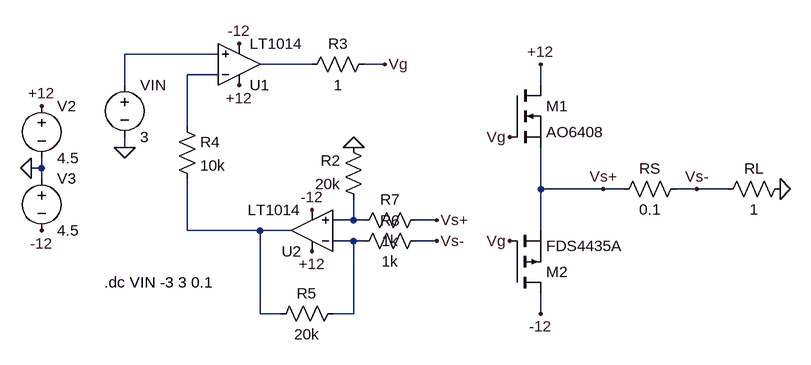
[diagram p0: schematic AmpOpDriverBipolar_v2.asc]
AmpOpDriverBipolar_v2.asc, the LTspice schematic file:
Version 4
SHEET 1 880 680
WIRE -368 -64 -512 -64
WIRE -224 -48 -304 -48
WIRE -112 -48 -144 -48
WIRE -368 -32 -416 -32
WIRE -512 -16 -512 -64
WIRE 128 -16 128 -48
WIRE -416 48 -416 -32
WIRE -512 80 -512 64
WIRE -640 112 -640 96
WIRE -640 112 -656 112
WIRE -640 128 -640 112
WIRE 128 144 128 80
WIRE 224 144 128 144
WIRE 256 144 224 144
WIRE 368 144 336 144
WIRE 416 144 368 144
WIRE -160 192 -160 160
WIRE -160 192 -192 192
WIRE -144 192 -160 192
WIRE -32 192 -64 192
WIRE -416 208 -416 128
WIRE -304 208 -416 208
WIRE -256 208 -304 208
WIRE 128 208 128 144
WIRE -160 224 -192 224
WIRE -144 224 -160 224
WIRE -32 224 -64 224
WIRE -304 336 -304 208
WIRE -272 336 -304 336
WIRE -160 336 -160 224
WIRE -160 336 -192 336
WIRE 128 336 128 304
FLAG 496 144 0
FLAG 128 -48 +12
FLAG -112 -48 Vg
FLAG -32 192 Vs+
FLAG -32 224 Vs-
FLAG 80 64 Vg
FLAG -656 112 0
FLAG -640 16 +12
FLAG -224 240 +12
FLAG -336 -16 +12
FLAG -640 208 -12
FLAG -512 80 0
FLAG -224 176 -12
FLAG -336 -80 -12
FLAG -160 80 0
FLAG 128 336 -12
FLAG 224 144 Vs+
FLAG 368 144 Vs-
FLAG 80 224 Vg
SYMBOL res 240 160 R270
WINDOW 0 32 56 VTop 2
WINDOW 3 0 56 VBottom 2
SYMATTR InstName RS
SYMATTR Value 0.1
SYMBOL res 512 128 R90
WINDOW 0 0 56 VBottom 2
WINDOW 3 32 56 VTop 2
SYMATTR InstName RL
SYMATTR Value 1
SYMBOL OpAmps\\LT1014 -336 16 M180
SYMATTR InstName U1
SYMBOL OpAmps\\LT1014 -224 272 R180
SYMATTR InstName U2
SYMBOL res -128 -64 R90
WINDOW 0 0 56 VBottom 2
WINDOW 3 32 56 VTop 2
SYMATTR InstName R3
SYMATTR Value 1
SYMBOL res -432 32 R0
SYMATTR InstName R4
SYMATTR Value 10k
SYMBOL res -176 320 R90
WINDOW 0 0 56 VBottom 2
WINDOW 3 32 56 VTop 2
SYMATTR InstName R5
SYMATTR Value 20k
SYMBOL res -48 208 R90
WINDOW 0 0 56 VBottom 2
WINDOW 3 32 56 VTop 2
SYMATTR InstName R6
SYMATTR Value 1k
SYMBOL voltage -512 -32 R0
WINDOW 123 0 0 Left 0
WINDOW 39 0 0 Left 0
SYMATTR InstName VIN
SYMATTR Value 3
SYMBOL voltage -640 0 R0
WINDOW 123 0 0 Left 0
WINDOW 39 0 0 Left 0
SYMATTR InstName V2
SYMATTR Value 4.5
SYMBOL voltage -640 112 R0
WINDOW 123 0 0 Left 0
WINDOW 39 0 0 Left 0
SYMATTR InstName V3
SYMATTR Value 4.5
SYMBOL nmos 80 -16 R0
SYMATTR InstName M1
SYMATTR Value AO6408
SYMBOL res -144 176 R180
WINDOW 0 36 76 Left 2
WINDOW 3 36 40 Left 2
SYMATTR InstName R2
SYMATTR Value 20k
SYMBOL res -48 176 R90
WINDOW 0 0 56 VBottom 2
WINDOW 3 32 56 VTop 2
SYMATTR InstName R7
SYMATTR Value 1k
SYMBOL pmos 80 304 M180
SYMATTR InstName M2
SYMATTR Value FDS4435A
TEXT -544 288 Left 2 !.dc VIN -3 3 0.1

The netlist it stands for:
* AmpOpDriverBipolar_v2.asc
RS Vs+ Vs- 0.1
RL 0 Vs- 1
XU1 N001 N003 +12 -12 N002 LT1014  ; pins In+ In- V+ V- OUT
XU2 N004 N006 +12 -12 N005 LT1014  ; pins In+ In- V+ V- OUT
R3 Vg N002 1
R4 N003 N005 10k
R5 N006 N005 20k
R6 Vs- N006 1k
VIN N001 0 3
V2 +12 0 4.5
V3 0 -12 4.5
M1 +12 Vg Vs+ Vs+ AO6408
R2 N004 0 20k
R7 Vs+ N004 1k
M2 -12 Vg Vs+ Vs+ FDS4435A
.model NMOS NMOS
.model PMOS PMOS
.lib standard.mos
.dc VIN -3 3 0.1
.backanno
.end